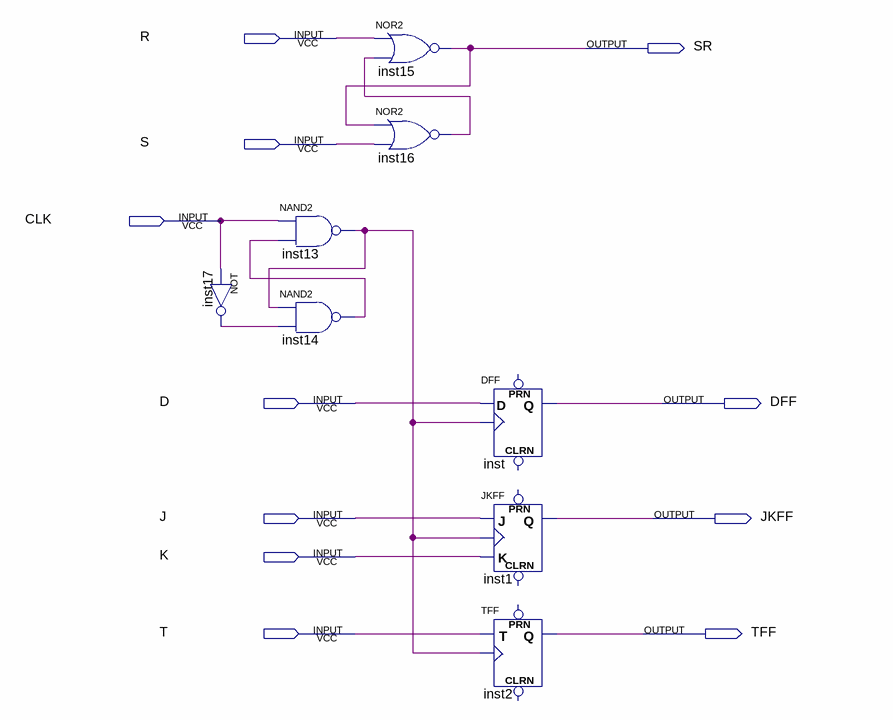
[diagram p0: schematic sheet]
// Quartus schematic SR.bdf as structural Verilog: 8 symbols, 11 pins
module SR (
  input  R,
  input  S,
  input  CLK,
  input  D,
  input  J,
  input  K,
  input  T,
  output SR,
  output DFF,
  output JKFF,
  output TFF
);

  wire inst13_out, inst14_out, inst16_out, inst17_out;

  not inst17 (inst17_out, CLK);
  nand inst13 (inst13_out, CLK, inst14_out);
  nand inst14 (inst14_out, inst13_out, inst17_out);
  nor inst15 (SR, R, inst16_out);
  nor inst16 (inst16_out, SR, S);
  DFF inst (.CLK(inst13_out), .D(D), .Q(DFF));  // open: CLRN, PRN
  JKFF inst1 (.K(K), .J(J), .CLK(inst13_out), .Q(JKFF));  // open: PRN, CLRN
  TFF inst2 (.T(T), .CLK(inst13_out), .Q(TFF));  // open: PRN, CLRN
endmodule
